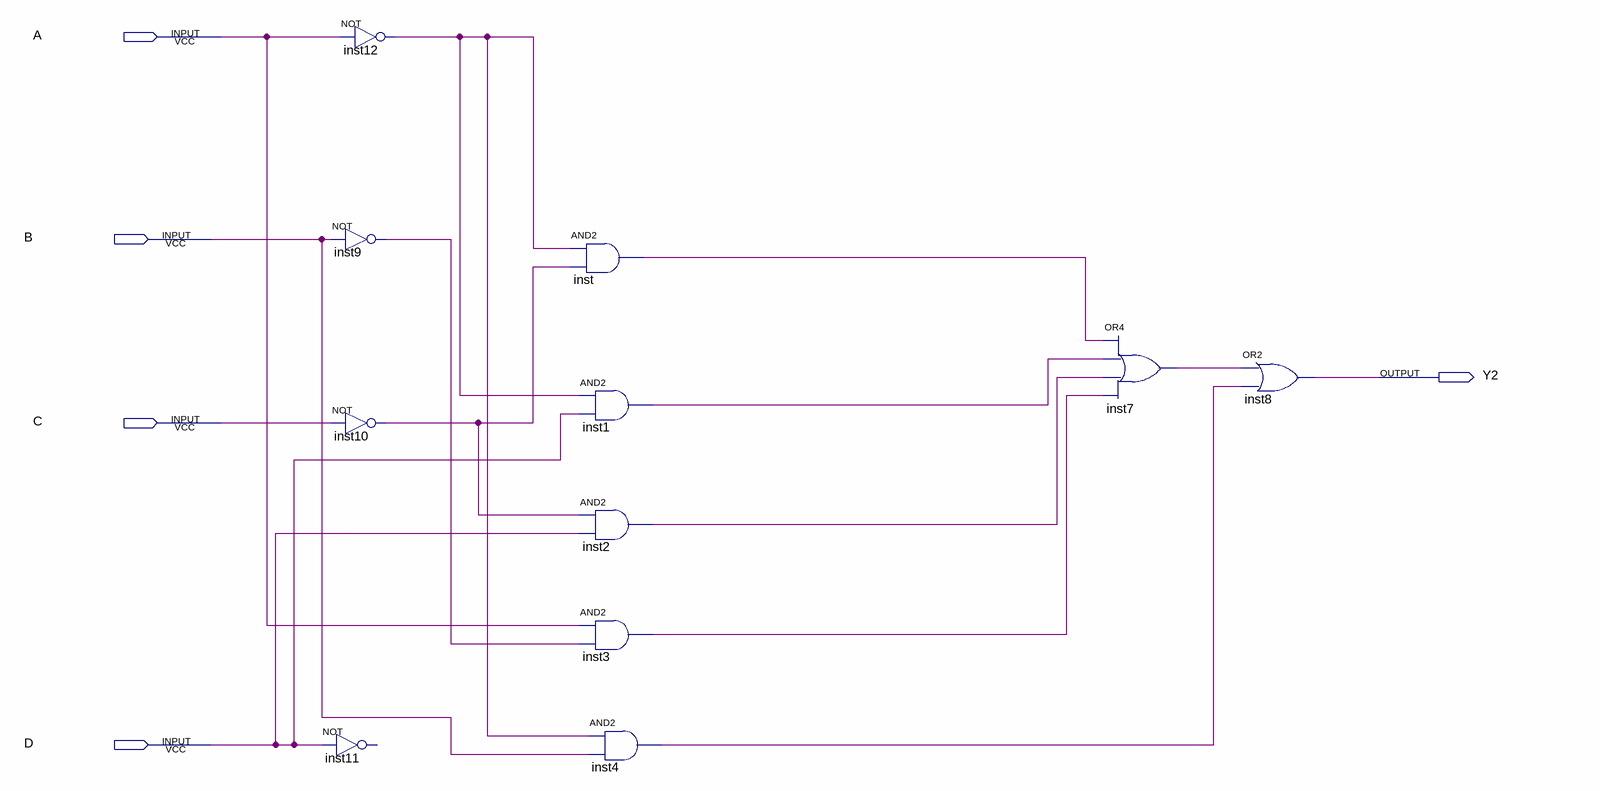
[diagram p0: schematic sheet]
// Quartus schematic two.bdf as structural Verilog: 11 symbols, 5 pins
module two (
  input  A,
  input  B,
  input  C,
  input  D,
  output Y2
);

  wire inst1_out, inst2_out, inst3_out, inst4_out, inst7_out, inst9_out, inst10_out, inst12_out, inst_out;

  not inst12 (inst12_out, A);
  not inst9 (inst9_out, B);
  not inst10 (inst10_out, C);
  // NOT inst11 has open pins: IN=D, OUT=open
  and inst (inst_out, inst12_out, inst10_out);
  and inst1 (inst1_out, inst12_out, D);
  and inst2 (inst2_out, inst10_out, D);
  and inst3 (inst3_out, A, inst9_out);
  and inst4 (inst4_out, inst12_out, B);
  or inst7 (inst7_out, inst_out, inst1_out, inst2_out, inst3_out);
  or inst8 (Y2, inst7_out, inst4_out);
endmodule
